# EAGLE design BQ76920 Protoboard 2 (EAGLE 8.3.2)
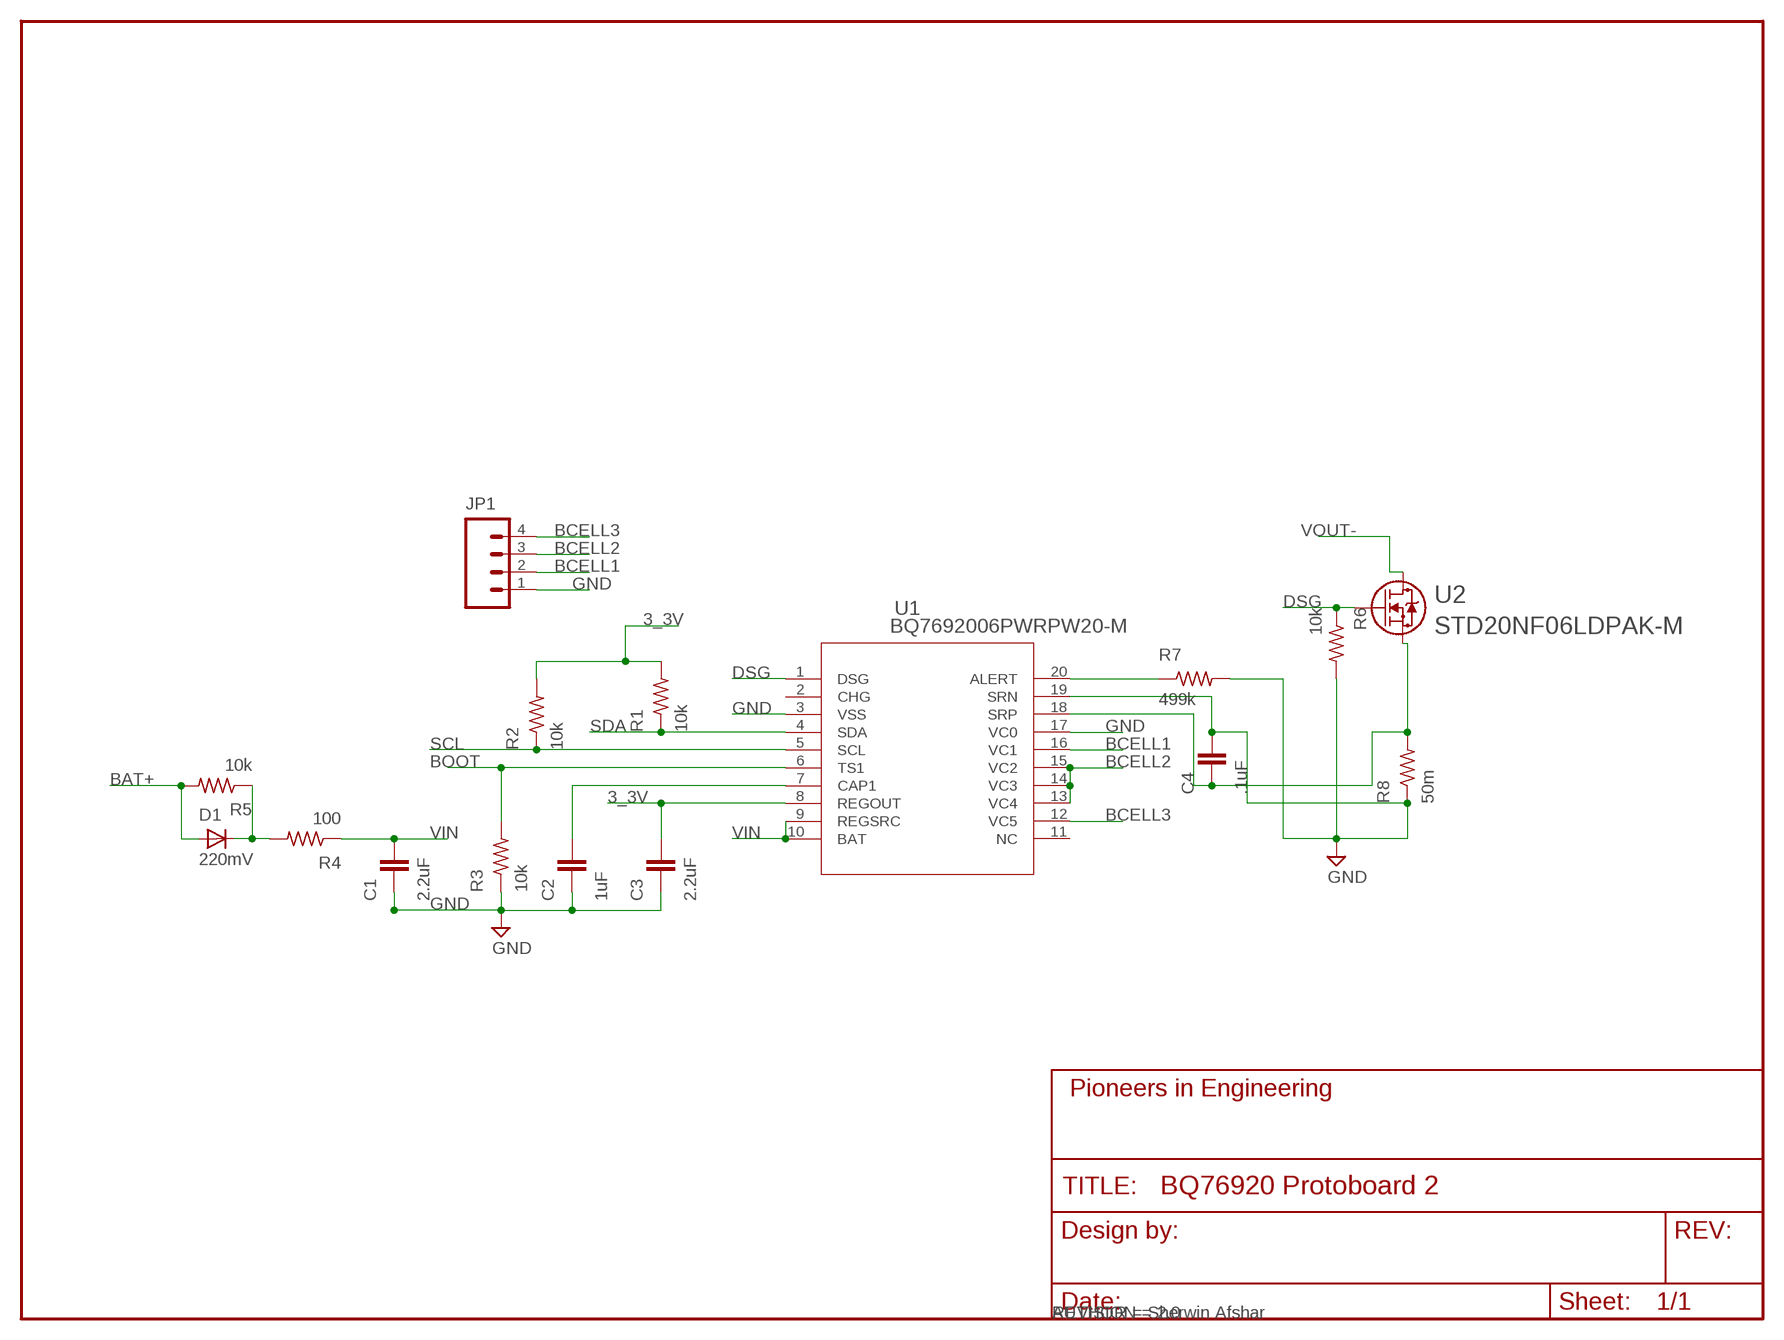
[diagram p0: schematic, sheet 1]
FRAME1 (FRAME_SCHEMATIC): AUTHOR: Sherwin Afshar; REVISION: 2.0

## Parts
C1  2.2uF  CAP0603-CAP  [0603-CAP]
C2  1uF  CAP0603-CAP  [0603-CAP]
C3  2.2uF  CAP0603-CAP  [0603-CAP]
C4  .1uF  CAP0603-CAP  [0603-CAP]
D1  220mV  DIODESOD-323  [SOD-323]
JP1  M041X04-MTA  [1X04-MTA]
R1  10k  R-US_R0603  [R0603]
R2  10k  R-US_R0603  [R0603]
R3  10k  R-US_R0603  [R0603]
R4  100  R-US_R0603  [R0603]
R5  10k  R-US_R0603  [R0603]
R6  10k  R-US_R0603  [R0603]
R7  499k  R-US_R0603  [R0603]
R8  50m  R-US_R2512  [R2512]
U1  BQ7692006PWRPW20-M  [PW20-M]
U2  STD20NF06LDPAK-M  [DPAK-M]

## Nets
3_3V: C3.2 R1.2 R2.2 U1.8(REGOUT)
ALERT: R7.1 U1.20(ALERT)
BAT+: D1.1(A) R5.2
BCELL1: JP1.2 U1.16(VC1)
BCELL2: JP1.3 U1.13(VC4) U1.14(VC3) U1.15(VC2)
BCELL3: JP1.4 U1.12(VC5)
BOOT: R3.2 U1.6(TS1)
CAP1: C2.2 U1.7(CAP1)
DSG: R6.1 U1.1(DSG) U2.1
GND: C1.1 C2.1 C3.1 C4.2 JP1.1 R3.1 R6.2 R7.2 R8.1 U1.3(VSS) U1.17(VC0) U1.19(SRN)
N$3: D1.2(C) R4.2 R5.1
SCL: R2.1 U1.5(SCL)
SDA: R1.1 U1.4(SDA)
SOURCE: C4.1 R8.2 U1.18(SRP) U2.2
VIN: C1.2 R4.1 U1.9(REGSRC) U1.10(BAT)
VOUT-: U2.3
Unconnected: U1.2(CHG) U1.11(NC)

## Library data of the parts
C1-C4 = pie:CAP: Capacitor Standard 0603 ceramic capacitor, and 0.1" leaded capacitor.; PIE-INT-REF-NUM: CAPACITOR-GENERIC
D1 = pie:DIODE: Diode These are standard reverse protection diodes and small signal diodes. SMA package can handle up to about 1A. SOD-323 can handle about 200mA. What the SOD-323 package when ordering, there are some mfgs out there that are 5-pin packages.; PIE-INT-REF-NUM: DIODE
JP1 = pie:M04: 4-pin 0.1-inch header and MTA connector; PIE-INT-REF-NUM: MTA
R1-R7 = pie:R-US_: RESISTOR, American symbol; DESCRIPTION: RESISTOR, American symbol; DISTRIBUTOR: DigiKey; MANUFACTURER: Rohm Semiconductor; NOTES: Cut Tape; PACKAGE: R0603; VALUE: >VALUE
R8 = pie:R-US_: RESISTOR, American symbol; PIE-INT-REF-NUM: RESISTOR-GENERIC
U1 = pie:BQ7692006PWR; MANUFACTURER_PART_NUMBER: BQ7692006PWR; VENDOR: Texas Instruments
U2 = pie:STD20NF06L; MANUFACTURER_PART_NUMBER: STD20NF06L; VENDOR: STMicroelectronics

## Board
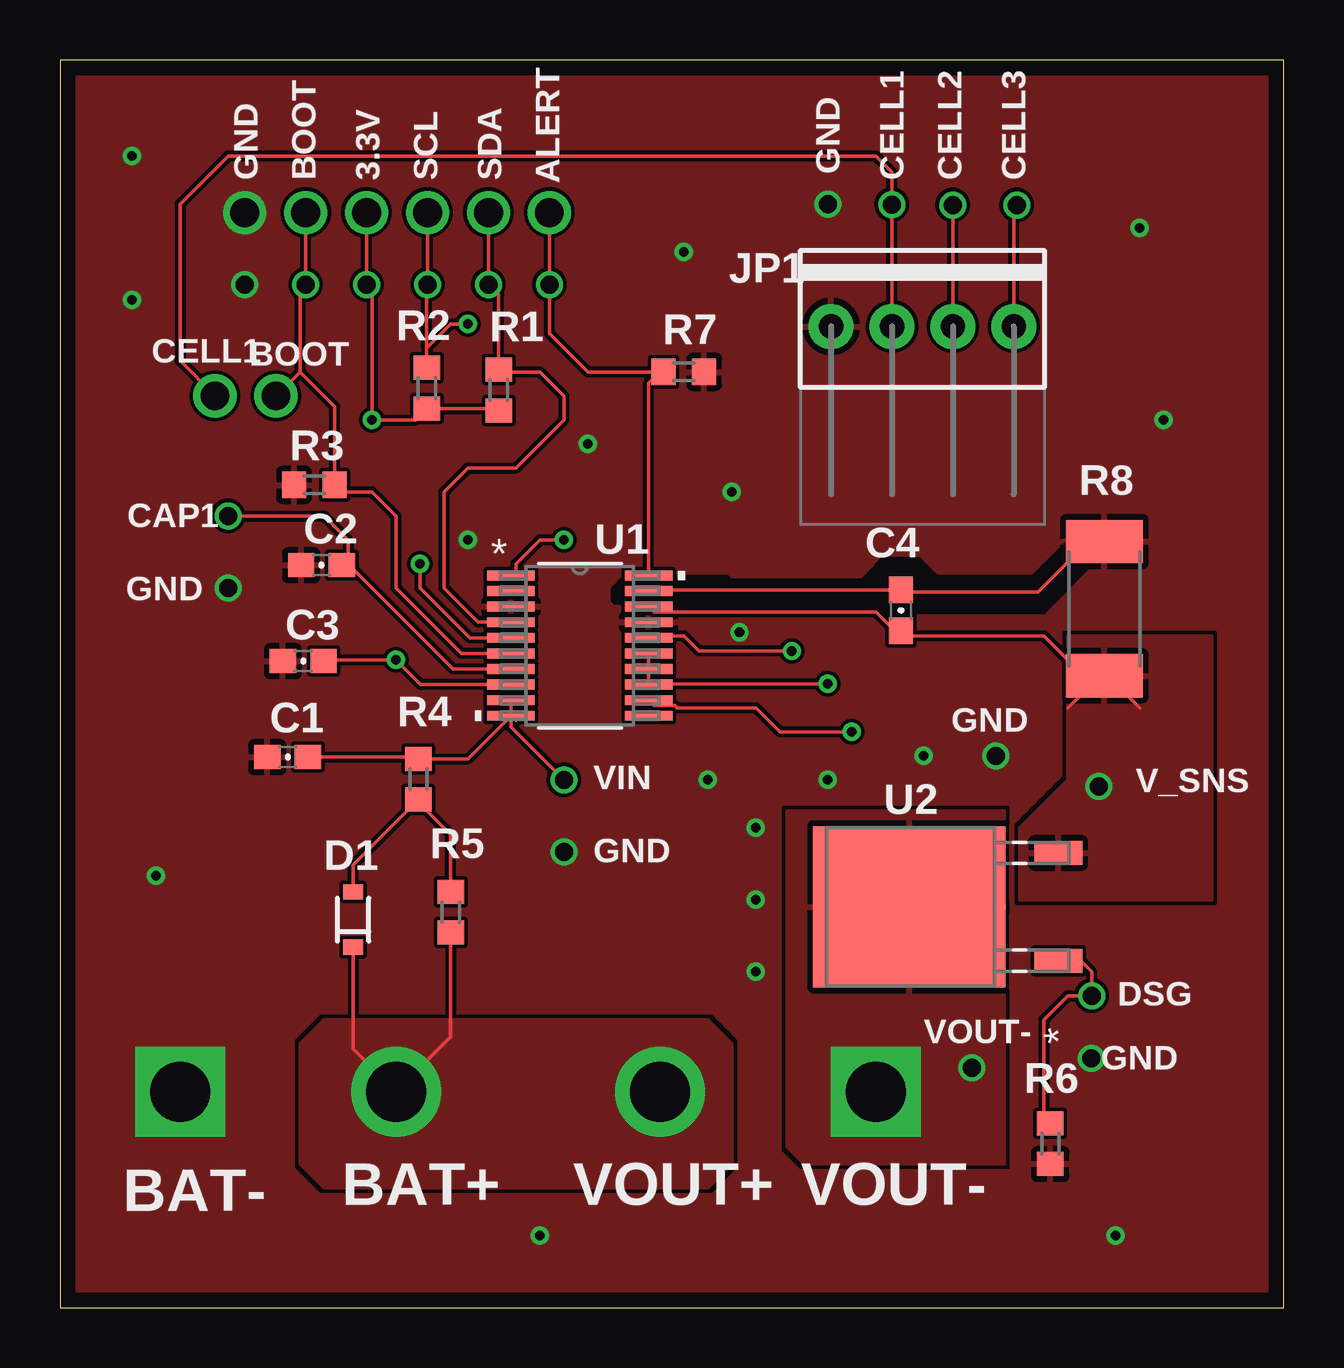
[diagram p1: board, top side]
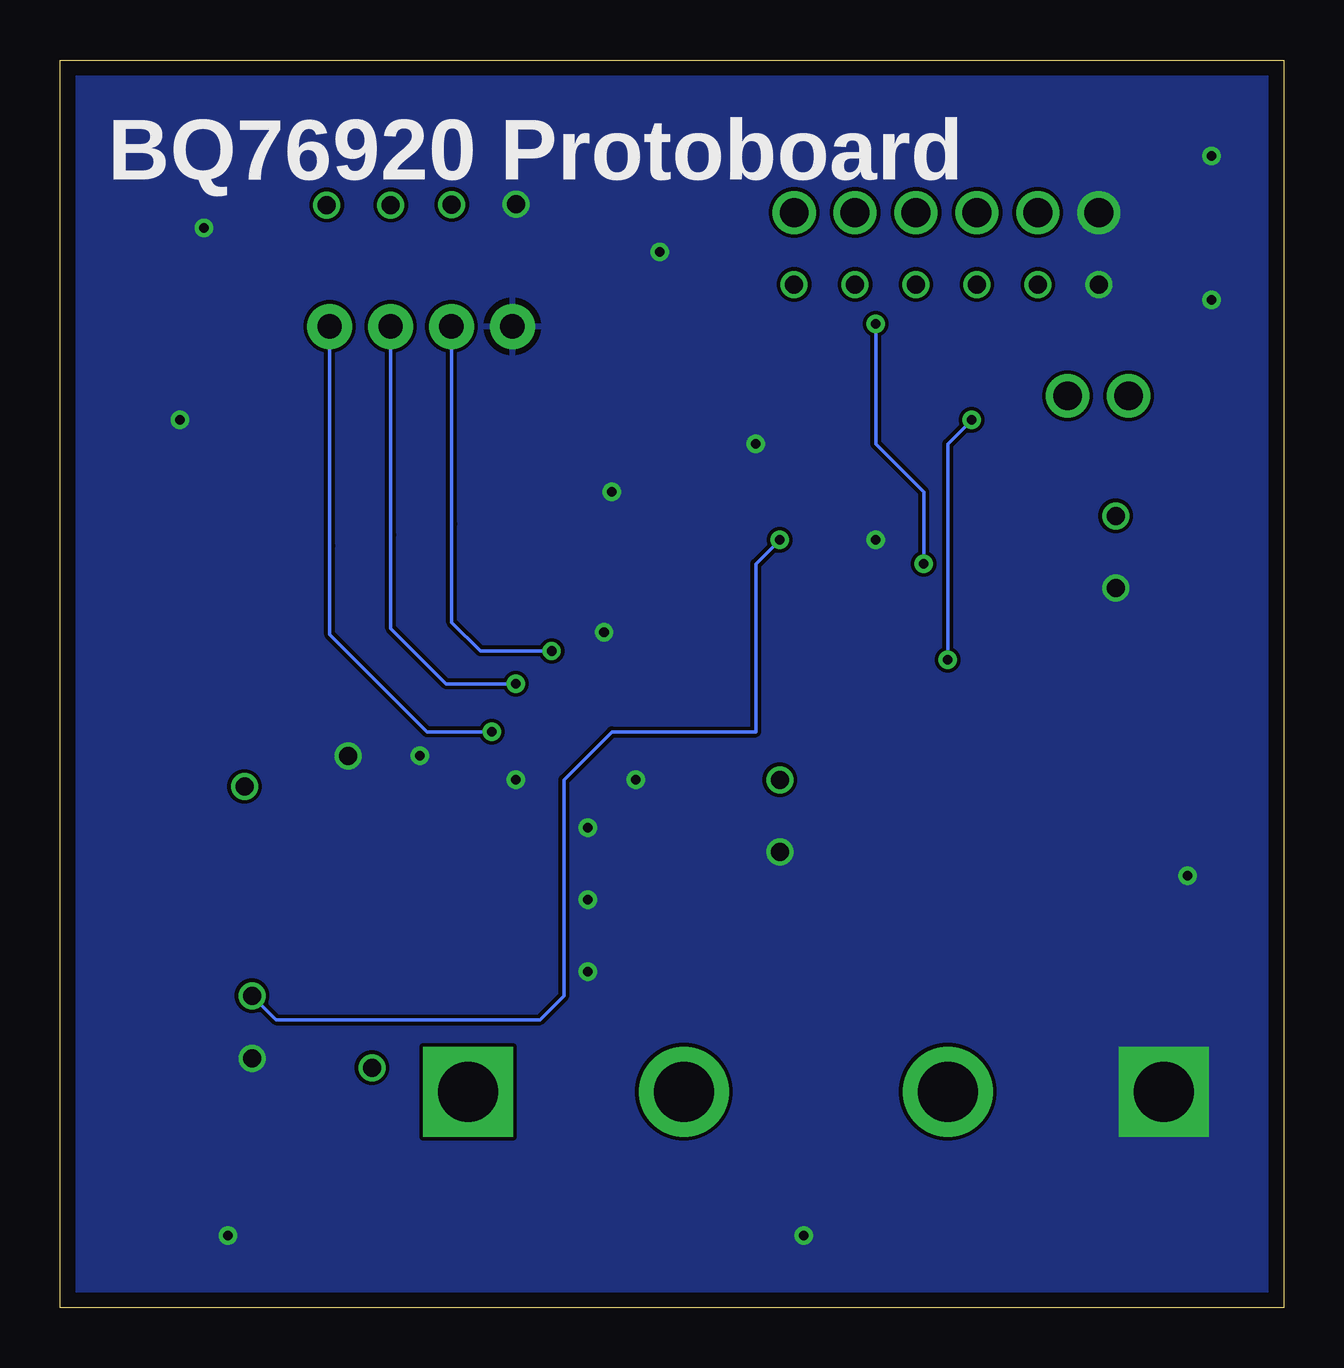
[diagram p2: board, bottom side, seen from below]

Size 51 x 52 mm. Coordinates in mm from the lower left corner, seen from the top.
Outline: 0,0 51,0 51,52 0,52 0,0
Copper layers (1*16): Top 2mil / dielectric 9mil / Bottom 2mil
Design rules "pie": minimum track width 6mil, minimum drill 15mil, track to track 6mil, track to pad 6mil, pad to pad 6mil, via to via 6mil, smd to smd 6mil, copper to edge 25mil, drill to drill 7mil, minimum pad ring 7mil, minimum via ring 7mil, stop-mask expansion 3mil, vias tented up to drill 21mil, thermal gap 10mil

### Footprints (pad centres in the part's own frame; a part is rotated, then mirrored left to right if it is on the bottom)
0603-CAP = smd 1.1 x 1: 1 -0.85,0; 2 0.85,0
SOD-323 = smd 0.63 x 0.83: 1 -1.15,0; 2 1.15,0
1X04-MTA = drill 1.016 pad 1.88: 1 -3.81,0; 2 -1.27,0; 3 1.27,0; 4 3.81,0
R0603 = smd 1 x 1.1: 1 -0.85,0; 2 0.85,0
R2512 = smd 1.8 x 3.2: 1 -2.8,0; 2 2.8,0
PW20-M = smd 1.981 x 0.406: 1 -2.87,2.925; 2 -2.87,2.275; 3 -2.87,1.625; 4 -2.87,0.975; 5 -2.87,0.325; 6 -2.87,-0.325; 7 -2.87,-0.975; 8 -2.87,-1.625; 9 -2.87,-2.275; 10 -2.87,-2.925; 11 2.87,-2.925; 12 2.87,-2.275; 13 2.87,-1.625; 14 2.87,-0.975; 15 2.87,-0.325; 16 2.87,0.325; 17 2.87,0.975; 18 2.87,1.625; 19 2.87,2.275; 20 2.87,2.925
DPAK-M = smd 0.991 x 2.007: 1 -2.25,-6.16; 2 2.25,-6.16 | smd 6.706 x 8.026: 3 0,0.051

### Placement (x,y rotation side)
C1  9.49,22.94 0 top
C2  10.9,30.94 0 top
C3  10.14,26.94 0 top
C4  35.06,29.06 90 top
D1  12.22,16.17 90 top
JP1  35.95,40.89 0 top
R1  18.29,38.24 270 top
R2  15.29,38.32 270 top
R3  10.6,34.29 0 top
R4  14.94,22.02 270 top
R5  16.29,16.48 270 top
R6  41.27,6.83 270 top
R7  26,39 0 top
R8  43.53,29.13 270 top
U1  21.67,27.59 0 top
U2  35.45,16.7 90 top

### Tracks (layer width: path | path; a pad name or v marks a point on that pad's centre or on a via)
3_3V  (via drill 0.4, 0.75, 1.2)
  Top 0.152: 18.77,25.94 U1.8 15.04,25.96 v14,27 11.05,27 C3.2 | 17.9,37 R1.2 18.21,37.47 R2.2 14.82,37 v13,37 13,42.42 v12.78,42.64 v12.78,45.64
  Bottom 0.152: v14,27 14,36 v13,37
ALERT  (via drill 0.75, 1.2)
  Top 0.152: 25,39 22,39 20.4,40.6 v20.4,42.64 v20.4,45.64 | 25,39 R7.1 | U1.20 24.54,38.54 25,39
BAT+  (via drill 2.5)
  Top 0.152: D1.1 12.22,10.78 v14,9 16.29,11.29 R5.2
  other vias: 25,9
  pour Top: 11,12 27,12 28,11 28,6 27,5 11,5 10,6 10,11
BCELL1  (via drill 0.4, 0.75, 1.2)
  Top 0.152: U1.16 24.62,28 26,28 26.64,27.36 v30.51,27.36 | JP1.2 v34.67,45.97 34.67,47.33 34,48 7,48 5,46 5,39.46 v6.46,38
  Bottom 0.152: JP1.2 34.68,32.68 34.67,32.67 34.67,28.56 33.48,27.36 v30.51,27.36
BCELL2  (via drill 0.4, 0.75)
  Top 0.152: v32,26 24.57,26 U1.13 U1.14 U1.15 | JP1.3 37.22,45.95 v37.21,45.96
  Bottom 0.152: JP1.3 37.22,32.22 37.21,32.21 37.21,28.3 34.91,26 v32,26
BCELL3  (via drill 0.4, 0.75)
  Top 0.152: v33,24 30,24 29,25 25.72,25 25.62,25.1 24.76,25.1 U1.12 | JP1.4 39.76,45.84 v39.88,45.96
  Bottom 0.152: JP1.4 39.76,31.76 39.75,31.75 39.75,28.05 35.7,24 v33,24
BOOT  (via drill 0.75, 1.2)
  Top 0.152: U1.6 16.73,27.27 14,30 14,33 13,34 11.74,34 R3.2 11.45,37.55 10,39 | 10,39 10,42.4 v10.24,42.64 v10.24,45.64 | 10,39 v9,38
CAP1  (via drill 0.75)
  Top 0.152: U1.7 16.39,26.61 11.9,31.09 | v7,33 11,33 12,32 12,31.19 11.9,31.09 | 11.9,31.09 C2.2
DSG  (via drill 0.4, 0.75)
  Top 0.152: U2.1 42.55,14.45 43,14 v43,13 42,13 41,12 41,7.95 R6.1 | v21,32 20,32 19,31 19,30.71 U1.1
  Bottom 0.152: v43,13 42,12 31,12 30,13 30,22 28,24 22,24 22,31 v21,32
GND  (via drill 0.4, 0.75, 1.2, 2.5)
  Top 0.152: U1.19 24.59,29.91 C4.2 35.14,29.83 40.77,29.83 42.87,31.93 R8.1
  other vias: 5,9 7.7,42.64 3,42 4,18 7.7,45.64 3,48 46,37 26,44 22,36 7,30 28.32,28.15 39,23 32,46 28,34 29,14 42.98,10.38 21,19 45,45 20,3 27,22 32,22 29,20 29,17 44,3 36,23 17,32
  pour Bottom: 0,52 51,52 51,0 0,0
  pour Top (rank 2): 0,52 51,52 51,0 0,0
N$2
  cutout Top: 27.81,30.48 23.48,30.48 23,30 23,29.45 23.11,29.34 33.91,29.34 34.29,28.96 41.02,28.96 43.56,31.5 43.56,31.62 43.18,32 42.04,32 40.51,30.48 36.58,30.48 35.81,31.24 34.24,31.24 34,31 34,30.95 33.4,30.35 27.94,30.35
N$3
  Top 0.152: D1.2 12.22,18.45 14.88,21.11 | 14.88,21.11 R4.2 | R5.1 16.29,19.71 14.88,21.11
SCL  (via drill 0.4, 0.75, 1.2)
  Top 0.152: 15.29,40 R2.1 | 15.29,40 15.29,42.61 v15.32,42.64 v15.32,45.64 | U1.5 17.09,27.91 15,30 v15,31 | v17,41 16.29,41 15.29,40
  Bottom 0.152: v15,31 15,34 17,36 v17,41
SDA  (via drill 0.75, 1.2)
  Top 0.152: U1.4 17.43,28.57 16,30 16,34 17,35 19,35 21,37 21,38 20,39 18.38,39 R1.1 18.29,42.21 v17.86,42.64 v17.86,45.64
SOURCE  (via drill 0.75)
  Top 0.152: U1.18 24.75,29 34,29 34.79,28.21 C4.1 35.27,28 41,28 42.67,26.33 43.33,26.33 | 43.33,26.33 R8.2 43.67,26.33 45,25 | 43.33,26.33 42,25
  other vias: 43.31,21.72
  pour Top: 42,28 42,22 40,20 40,17 48,17 48,28
VIN  (via drill 0.75)
  Top 0.152: 19,24.46 U1.10 | U1.10 U1.9 | 15,22.87 R4.1 | 15,22.87 17,22.87 U1.10 | U1.10 18.8,24.2 v21,22 | C1.2 14.93,22.94 15,22.87
VOUT-  (via drill 0.75, 2.5)
  other vias: 34,9 38,10
  pour Top: 31,6 39.34,6 39.37,5.97 39.37,20.7 30.3,20.7 30.3,6.7

### Text on the board
tNames: GND | BOOT | 3.3V | SCL | SDA | ALERT | GND | CELL1 | CELL2 | CELL3 | BOOT | CELL1 | CAP1 | GND | GND | VIN | V_SNS | GND | DSG | VOUT- | GND | BAT- | BAT+ | VOUT+ | VOUT-
bNames: BQ76920 Protoboard